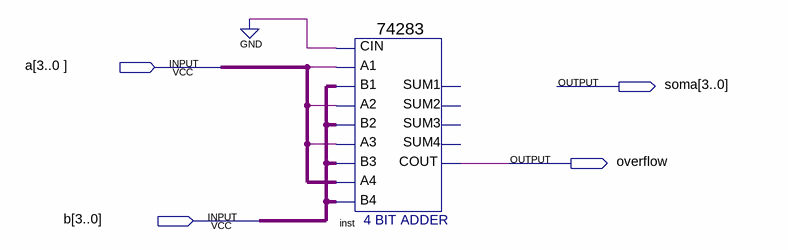
[diagram p0: schematic sheet]
// Quartus schematic calcRev1.bdf as structural Verilog: 1 symbols, 4 pins
module calcRev1 (
  input  [3:0] a,
  input  [3:0] b,
  output [3:0] soma,
  output overflow
);

  wire undriven, undriven_2, undriven_3;

  \74283  inst (
    .CIN(1'b0), .A1(undriven_3), .A2(undriven_2), .B2(b), .A3(undriven), .A4(a), .B4(b), .B1(b), .B3(b),
    .COUT(overflow));  // open: SUM4, SUM1, SUM2, SUM3
endmodule
